# Altium schematic sheet 33 Change List.SchDoc
size 386 x 246 mm
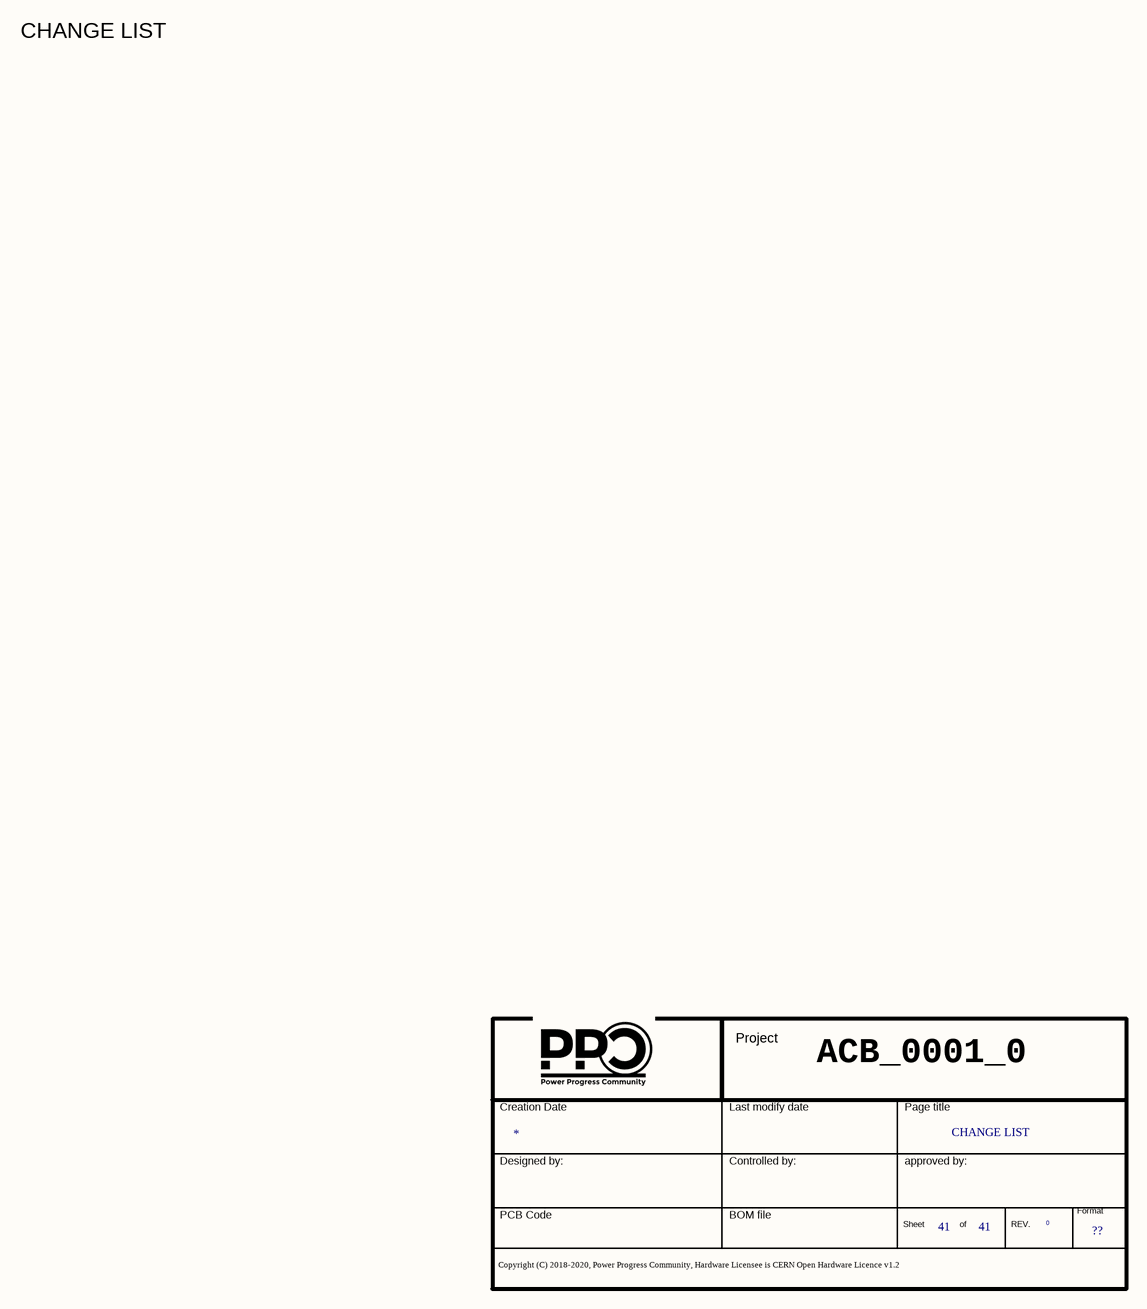
[diagram p0: 33 Change List.SchDoc]

## Parts
*  Doc: CHANGE LIST  Page Count: 41  Page Size: ??  RevCode: 0  (hidden comment: Title_block_PPC)  (graphical)

## Notes on the sheet
- CHANGE LIST
- ACB_0001_0
- (in symbol Title_block_PPC) Project; Creation Date; Last modify date; Page title; Designed by:; Controlled by:; approved by:; Format; PCB Code; BOM file; Sheet; of; REV.; Copyright (C) 2018-2020, Power Progress Community, Hardware Licensee is CERN Open Hardware Licence v1.2

## Library data of the parts
* = Title_block_PPC: Title: T1040RDB; Schematic Page Count: 45; Author: MICETEK; Page Create Date: March  8, 1995; Page Number: 41; Page Title: ?; Page Modify Date: *; Schematic Page Number: 45